# Altium project alertButton v2.0.PrjPcb
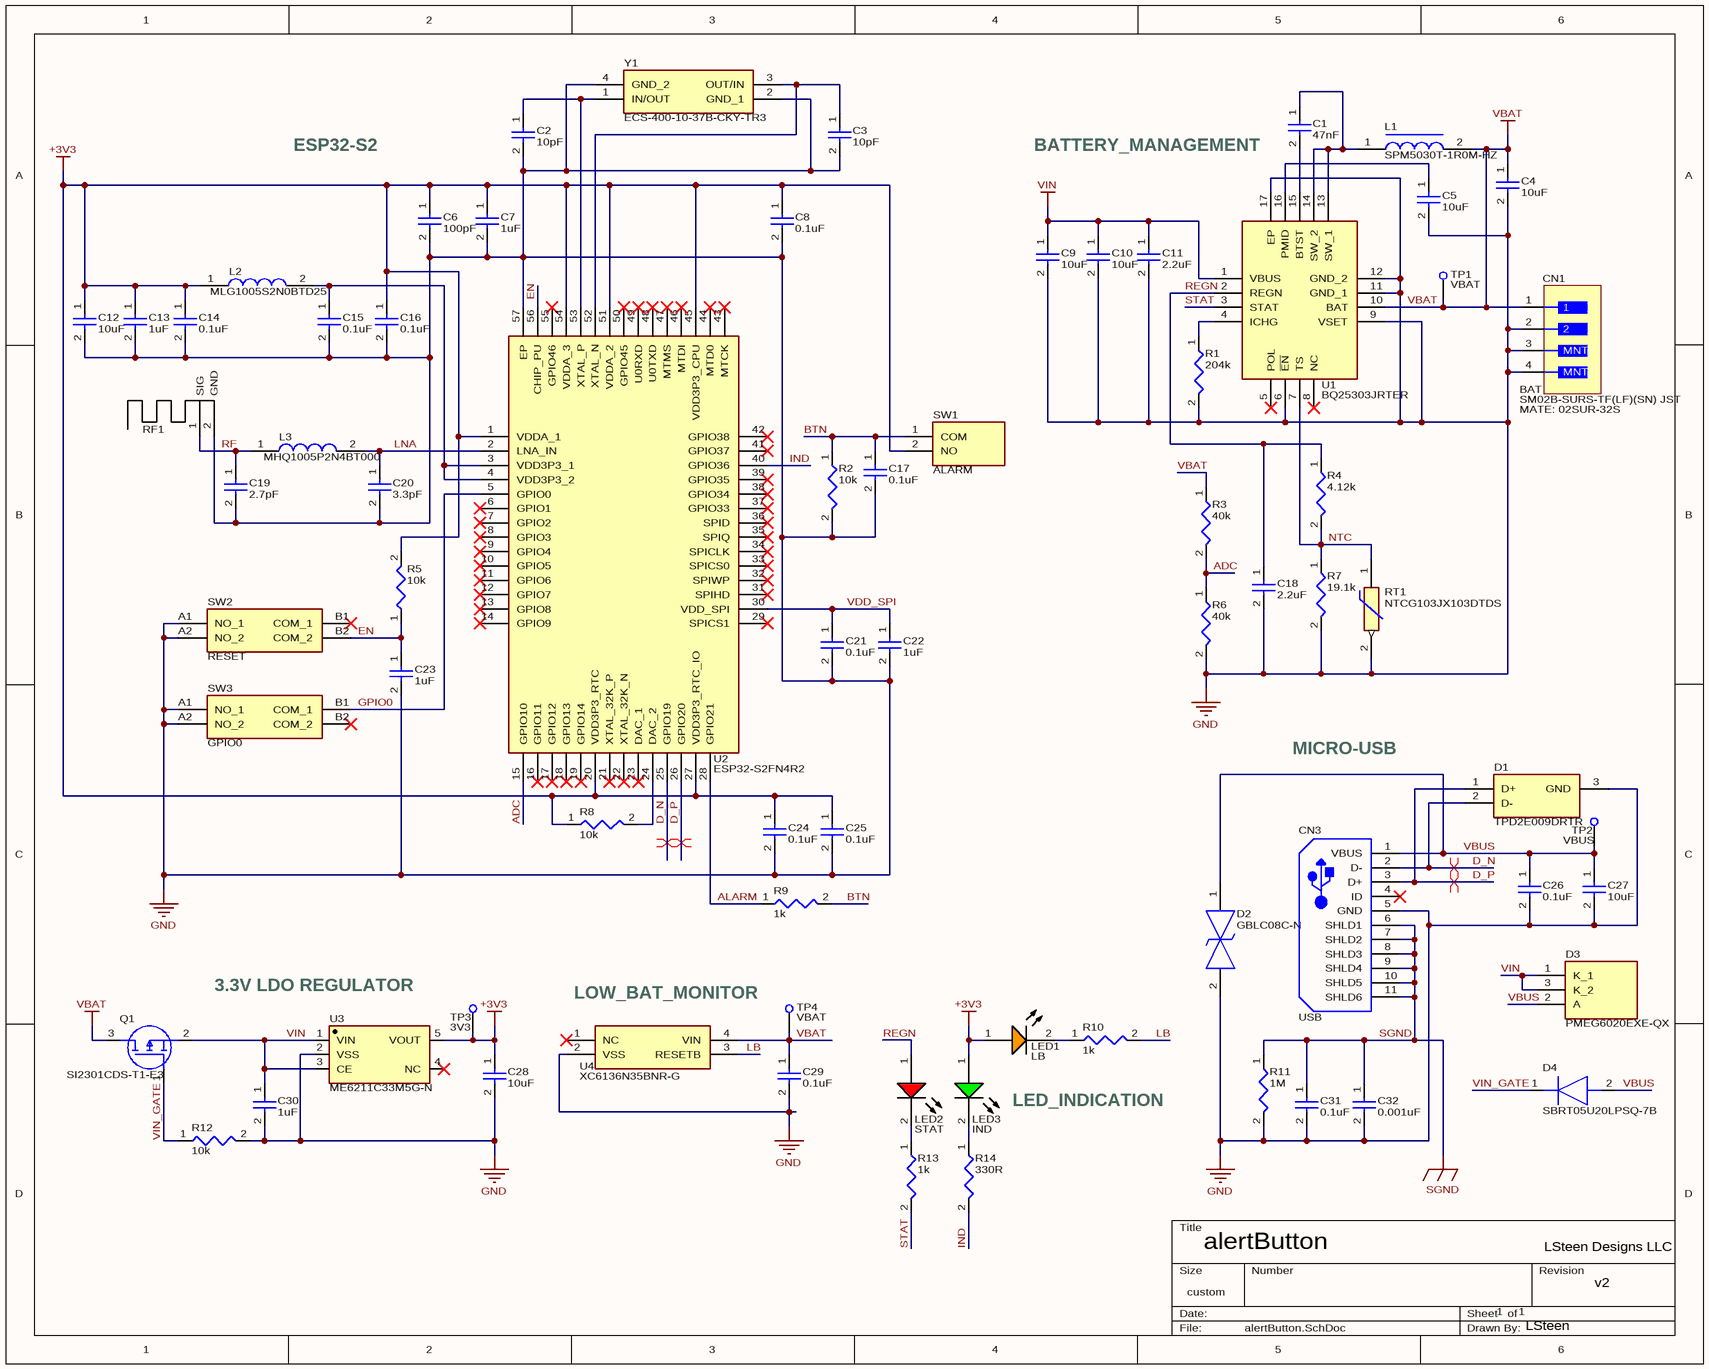
[diagram p0: alertButton.SchDoc]
1 sheet, 73 parts. Net scope: global (net labels, ports and power ports of the same name join across sheets).
Board file: alertButton.PcbDoc

## Sheet alertButton.SchDoc
size 299 x 240 mm

### Parts
C1  47nF  [CAPC1005X55N]
C2  10pF  [CAPC1005X55N]
C3  10pF  [CAPC1005X55N]
C4  10uF  [CAPC1608X90N]
C5  10uF  [CAPC1608X90N]
C6  100pF  [CAPC1005X55N]
C7  1uF  [CAPC1005X55N]
C8  0.1uF  [CAPC1005X55N]
C9  10uF  [CAPC1608X90N]
C10  10uF  [CAPC1608X90N]
C11  2.2uF  [CAPC1005X55N]
C12  10uF  [CAPC2012X140N]
C13  1uF  [CAPC1005X55N]
C14  0.1uF  [CAPC1005X55N]
C15  0.1uF  [CAPC1005X55N]
C16  0.1uF  [CAPC1005X55N]
C17  0.1uF  [CAPC1005X55N]
C18  2.2uF  [CAPC1005X55N]
C19  2.7pF  [CAPC1005X56N]
C20  3.3pF  [CAPC1005X56N]
C21  0.1uF  [CAPC1005X55N]
C22  1uF  [CAPC1005X55N]
C23  1uF  [CAPC1005X55N]
C24  0.1uF  [CAPC1005X55N]
C25  0.1uF  [CAPC1005X55N]
C26  0.1uF  [CAPC1005X55N]
C27  10uF  [CAPC1608X90N]
C28  10uF  [CAPC1608X90N]
C29  0.1uF  [CAPC1005X55N]
C30  1uF  [CAPC1005X55N]
C31  0.1uF  [CAPC1005X55N]
C32  0.001uF  [CAPC1005X55N]
CN1  BAT  [SM02B-SURS-TF(LF)(SN)]
CN3  USB  [105017-0001]
D1  TPD2E009DRTR  [SOTFL35P100X50-3N]
D2  GBLC08C-N  [SOD-323_L1.8-W1.3-LS2.5-BI]
D3  PMEG6020EXE-QX  [PMEG6020EXEQX]
D4  SBRT05U20LPSQ-7B  [SBRT05U20LPSQ7B]
L1  SPM5030T-1R0M-HZ  [SPM5030]
L2  MLG1005S2N0BTD25  [MLG1005]
L3  MHQ1005P2N4BT000  [MHQ1005]
LED1  LB  [SM0402OC]
LED2  STAT  [SM0402RC]
LED3  IND  [SM0402GC]
Q1  SI2301CDS-T1-E3  [SOT95P237X112-3N]
R1  204k  [ERA2AED122X]
R2  10k  [ERA2AED122X]
R3  40k  [ERA2AED122X]
R4  4.12k  [ERA2AED122X]
R5  10k  [ERA2AED122X]
R6  40k  [ERA2AED122X]
R7  19.1k  [ERA2AED122X]
R8  10k  [ERA2AED122X]
R9  1k  [ERA2AED122X]
R10  1k  [ERA2AED122X]
R11  1M  [ERA2AED122X]
R12  10k  [ERA2AED122X]
R13  1k  [ERA2AED122X]
R14  330R  [ERA2AED122X]
RF1  Antenna  [SWRA117D]  (value not drawn)
RT1  NTCG103JX103DTDS  [THRMC1005X55N]
SW1  ALARM  [TS1088R02026]
SW2  RESET  [EVPBB0AAB000]
SW3  GPIO0  [EVPBB0AAB000]
TP1  VBAT  [TP]  (no BOM)
TP2  VBUS  [TP]  (no BOM)
TP3  3V3  [TP]  (no BOM)
TP4  VBAT  [TP]  (no BOM)
U1  BQ25303JRTER  [QFN50P300X300X80-17N-D]
U2  ESP32-S2FN4R2  [QFN40P700X700X90-57N-D]
U3  ME6211C33M5G-N  [SOT95P270X145-5N]
U4  XC6136N35BNR-G  [XC6136C12ANRG]
Y1  ECS-400-10-37B-CKY-TR3  [ECS4001037BCKYTR3]

### Nets
+3V3: C6.1 C7.1 C8.1 C12.1 C13.1 C14.1 C16.1 C24.1 C25.1 C28.1 L2.1 LED1.1(A) LED3.1(A) R5.2 R8.1 SW1.2(NO) TP3.1 U2.1(VDDA_1) U2.20(VDD3P3_RTC) U2.27(VDD3P3_RTC_IO) U2.45(VDD3P3_CPU) U2.51(VDDA_2) U2.54(VDDA_3) U3.5(VOUT)
GND: C2.2 C3.2 C4.2 C5.2 C6.2 C7.2 C8.2 C9.2 C10.2 C11.2 C12.2 C13.2 C14.2 C15.2 C16.2 C17.2 C18.2 C19.2 C20.2 C21.2 C22.2 C23.2 C24.2 C25.2 C26.2 C27.2 C28.2 C29.2 C30.2 C31.2 C32.2 CN1.2 CN1.3(MNT) CN1.4(MNT) CN3.5(GND) D1.3(GND) D2.2 R1.2 R2.2 R6.2 R7.2 R11.2 R12.2 RF1.2(GND) RT1.2 SW2.A1(NO_1) SW2.A2(NO_2) SW3.A1(NO_1) SW3.A2(NO_2) U1.6(~{EN}) U1.9(VSET) U1.11(GND_1) U1.12(GND_2) U1.17(EP) U2.57(EP) U3.2(VSS) U4.2(VSS) Y1.2(GND_1) Y1.4(GND_2)
SGND: C31.1 C32.1 CN3.6(SHLD1) CN3.7(SHLD2) CN3.8(SHLD3) CN3.9(SHLD4) CN3.10(SHLD5) CN3.11(SHLD6) R11.1
VBAT: C4.1 C29.1 CN1.1 L1.2 Q1.3(D) R3.1 TP1.1 TP4.1 U1.10(BAT) U4.4(VIN)
VIN: C9.1 C10.1 C11.1 C30.1 D3.1(K_1) D3.3(K_2) Q1.2(S) U1.1(VBUS) U3.1(VIN) U3.3(CE)
ADC: R3.2 R6.1 U2.15(GPIO10)
ALARM: R9.1 U2.28(GPIO21)
BTN: C17.1 R2.1 R9.2 SW1.1(COM)
D_N: CN3.2(D-) D1.2(D-) U2.25(GPIO19)
D_P: CN3.3(D+) D1.1(D+) U2.26(GPIO20)
EN: C23.1 R5.1 SW2.B2(COM_2) U2.56(CHIP_PU)
GPIO0: SW3.B1(COM_1) U2.5(GPIO0)
IND: R14.2 U2.40(GPIO36)
LB: R10.2 U4.3(RESETB)
LNA: C20.1 L3.2 U2.2(LNA_IN)
NTC: R4.2 R7.1 RT1.1 U1.7(TS)
REGN: C18.1 LED2.1(A) R4.1 U1.2(REGN)
RF: C19.1 L3.1 RF1.1(SIG)
STAT: R13.2 U1.3(STAT)
VBUS: C26.1 C27.1 CN3.1(VBUS) D2.1 D3.2(A) D4.2(A) TP2.1
VDD_SPI: C21.1 C22.1 U2.30(VDD_SPI)
VIN_GATE: D4.1(K) Q1.1(G) R12.1
NetC1_1: C1.1 L1.1 U1.13(SW_1) U1.14(SW_2)
NetC1_2: C1.2 U1.15(BTST)
NetC2_1: C2.1 U2.53(XTAL_P) Y1.1(IN/OUT)
NetC3_1: C3.1 U2.52(XTAL_N) Y1.3(OUT/IN)
NetC5_1: C5.1 U1.16(PMID)
NetC15_1: C15.1 L2.2 U2.3(VDD3P3_1) U2.4(VDD3P3_2)
NetLED1_2: LED1.2(K) R10.1
NetLED2_2: LED2.2(K) R13.1
NetLED3_2: LED3.2(K) R14.1
NetR1_1: R1.1 U1.4(ICHG)
NetR8_2: R8.2 U2.24(DAC_2)

Not connected (* = marked no-connect by the designer): CN3 4(ID)*; SW2 B1(COM_1)*; SW3 B2(COM_2)*; U1 5(POL)* 8(NC)*; U2 6(GPIO1)* 7(GPIO2)* 8(GPIO3)* 9(GPIO4)* 10(GPIO5)* 11(GPIO6)* 12(GPIO7)* 13(GPIO8)* 14(GPIO9)* 16(GPIO11)* 17(GPIO12)* 18(GPIO13)* 19(GPIO14)* 21(XTAL_32K_P)* 22(XTAL_32K_N)* 23(DAC_1)* 29(SPICS1)* 31(SPIHD)* 32(SPIWP)* 33(SPICS0)* 34(SPICLK)* 35(SPIQ)* 36(SPID)* 37(GPIO33)* 38(GPIO34)* 39(GPIO35)* 41(GPIO37)* 42(GPIO38)* 43(MTCK)* 44(MTD0)* 46(MTDI)* 47(MTMS)* 48(U0TXD)* 49(U0RXD)* 50(GPIO45)* 55(GPIO46)*; U3 4(NC)*; U4 1(NC)*

### Layout directives
differential pair; differential pair class USB 2.0: D_N, D_P

### Notes on the sheet
- ESP32-S2
- BATTERY_MANAGEMENT
- (near CN1) MATE: 02SUR-32S
- (near CN1) SM02B-SURS-TF(LF)(SN) JST
- MICRO-USB
- 3.3V LDO REGULATOR
- (near U4) LOW_BAT_MONITOR
- LED_INDICATION
- alertButton
- LSteen Designs LLC
- 1
- v2
- LSteen

### Library data of the parts
C1-C3 C6-C8 C11 C13-C18 C21-C26 C29-C32 = C0402: Height: 0.55mm
C4 C5 C9 C10 C27 C28 = C0603: Height: 0.9mm
C12 = C0805: Height: 1.4mm
C19 = 04023U2R7BAT2A: C0402; Manufacturer_Name: Kyocera AVX; Datasheet Link: http://www.mouser.com/catalog/supplier/library/pdf/AVXSurfaceMountCeramic.pdf; Height: 0.56mm; Manufacturer_Part_Number: 04023U2R7BAT2A; Mouser Part Number: 581-04023U2.7B; Mouser Price/Stock: https://www.mouser.co.uk/ProductDetail/AVX/04023U2R7BAT2A?qs=btToBMqunHouu%252BPwi6Y2gg%3D%3D; Arrow Part Number: 04023U2R7BAT2A; Arrow Price/Stock: https://www.arrow.com/en/products/04023u2r7bat2a/avx
C20 = 04023A3R3CAT2A: C0402; Manufacturer_Name: Kyocera AVX; Datasheet Link: http://www.mouser.com/catalog/supplier/library/pdf/AVXSurfaceMountCeramic.pdf; Height: 0.56mm; Manufacturer_Part_Number: 04023A3R3CAT2A; Arrow Part Number: 04023A3R3CAT2A; Arrow Price/Stock: https://www.arrow.com/en/products/04023a3r3cat2a/avx
CN1 = SM02B-SURS-TF(LF)(SN): Connector; Manufacturer_Name: Apem; Datasheet Link: https://media.digikey.com/pdf/Data%20Sheets/APEM%20Components%20PDFs/APTCLGTV.pdf; Height: 1.87mm; Manufacturer_Part_Number: SM02B-SURS-TF(LF)(SN); Mouser Part Number: 306-SM02B-SURS-TF(LF)(SN); Mouser Price/Stock: https://www.mouser.co.uk/ProductDetail/Apem/APTCLGTVTR?qs=ikKlZSMjbcRNf%252Bwzp31ctg%3D%3D; Supplier 1: Mouser; LCSC_Part_Number: C566239
CN3 = 105017-0001: Micro USB Connector; Manufacturer_Name: Molex; Manufacturer_Part_Number: 105017-0001; Mouser Part Number: 538-105017-0001; Supplier 1: Mouser; Supplier 2: Digikey; Supplier Part Number 1: 538-105017-0001; Supplier Part Number 2: WM1399CT-ND
D1 = TPD2E009DRTR: Integrated Circuit; Manufacturer_Name: Texas Instruments; Datasheet Link: https://www.ti.com/lit/ds/symlink/tpd2e009.pdf?ts=1621336941637&ref_url=https%253A%252F%252Fwww.google.com%252F; Height: 0.5mm; Manufacturer_Part_Number: TPD2E009DRTR; Mouser Part Number: 595-TPD2E009DRTR; Mouser Price/Stock: https://www.mouser.co.uk/ProductDetail/Texas-Instruments/TPD2E009DRTR?qs=XGzIaZb%2FFYLhG8oL%2FM05Rg%3D%3D; Arrow Part Number: TPD2E009DRTR; Arrow Price/Stock: https://www.arrow.com/en/products/tpd2e009drtr/texas-instruments?region=nac; Supplier 1: Mouser; Supplier Part Number 1: 595-TPD2E009DRTR
D2 = GBLC08C-N: ESD DIODE-BI_LCSC#C314256
D3 = PMEG6020EXE-QX: Schottky Diode; Manufacturer_Name: Nexperia; Datasheet Link: https://assets.nexperia.com/documents/data-sheet/PMEG6020EXE-Q.pdf; Height: 1mm; Manufacturer_Part_Number: PMEG6020EXE-QX; Supplier 1: Mouser; Supplier Part Number 1: 771-PMEG6020EXE-Q
D4 = SBRT05U20LPSQ-7B: Diode; Manufacturer_Name: Diodes Incorporated; Datasheet Link: https://componentsearchengine.com/Datasheets/2/SBRT05U20LPSQ-7B.pdf; Height: 0.4mm; Manufacturer_Part_Number: SBRT05U20LPSQ-7B; Mouser Part Number: 621-SBRT05U20LPSQ-7B; Mouser Price/Stock: https://www.mouser.co.uk/ProductDetail/Diodes-Incorporated/SBRT05U20LPSQ-7B?qs=Cb2nCFKsA8rYOfAdmv62Rg%3D%3D; Arrow Part Number: SBRT05U20LPSQ-7B; Arrow Price/Stock: https://www.arrow.com/en/products/sbrt05u20lpsq-7b/diodes-incorporated?region=nac
L1 = SPM5030T-1R0M-HZ: Inductor (FeSi Core); Manufacturer_Name: TDK; Datasheet Link: https://product.tdk.com/system/files/dam/doc/product/inductor/inductor/smd/catalog/inductor_automotive_power_spm5030-hz_en.pdf; Manufacturer_Part_Number: SPM5030T-1R0M-HZ; Mouser Part Number: 810-SPM5030T-1R0M-HZ; Mouser Price/Stock: https://www.mouser.co.uk/ProductDetail/TDK/SPM5030T-1R0M-HZ?qs=lYGu3FyN48f37%252BxFpB09sg%3D%3D; Arrow Part Number: SPM5030T-1R0M-HZ; Arrow Price/Stock: https://www.arrow.com/en/products/spm5030t-1r0m-hz/tdk
L2 = MLG1005S2N0BTD25: Inductor; Manufacturer_Name: TDK; Datasheet Link: https://product.tdk.com/system/files/dam/doc/product/inductor/inductor/smd/catalog/inductor_automotive_high-frequency_mlg1005s_en.pdf; Manufacturer_Part_Number: MLG1005S2N0BTD25; Mouser Part Number: 810-MLG1005S2N0BTD25; Mouser Price/Stock: https://www.mouser.co.uk/ProductDetail/TDK/MLG1005S2N0BTD25?qs=u4%252BEJ9urDARbfrK%2Fvep%2FGg%3D%3D; Arrow Part Number: MLG1005S2N0BTD25; Arrow Price/Stock: https://www.arrow.com/en/products/mlg1005s2n0btd25/tdk; Supplier 1: LCSC; Supplier Part Number 1: C404617; Supplier 2: Mouser; Supplier Part Number 2: 810-MLG1005S2N0BTD25
L3 = MHQ1005P2N4BT000: Inductor; Manufacturer_Name: TDK; Datasheet Link: https://product.tdk.com/system/files/dam/doc/product/inductor/inductor/smd/catalog/inductor_commercial_high-frequency_mhq1005p_en.pdf; Manufacturer_Part_Number: MHQ1005P2N4BT000
LED1 = SM0402OC: LED ORANGE; Manufacturer_Name: Bivar; Datasheet Link: https://www.bivar.com/parts_content/Datasheets/SM0402OC.pdf; Height: 0.6524mm; Manufacturer_Part_Number: SM0402OC; Mouser Part Number: 749-SM0402OC; Arrow Part Number: SM0402OC
LED2 = SM0402RC: LED RED; Manufacturer_Name: Bivar; Datasheet Link: https://www.bivar.com/parts_content/Datasheets/SM0402RC.pdf; Height: 0.6524mm; Manufacturer_Part_Number: SM0402RC; Mouser Part Number: 749-SM0402RC; Mouser Price/Stock: https://www.mouser.co.uk/ProductDetail/Bivar/SM0402RC?qs=AQlKX63v8RtYE%2FAH%2F7Qnaw%3D%3D; Arrow Part Number: SM0402RC; Arrow Price/Stock: https://www.arrow.com/en/products/sm0402rc/bivar?region=nac
LED3 = SM0402GC: LED GREEN; Manufacturer_Name: Bivar; Datasheet Link: https://www.bivar.com/parts_content/Datasheets/SM0402GC.pdf; Height: 0.6524mm; Manufacturer_Part_Number: SM0402GC; Mouser Part Number: 749-SM0402GC; Mouser Price/Stock: https://www.mouser.co.uk/ProductDetail/Bivar/SM0402GC?qs=AQlKX63v8RuLeMPnNMtW7A%3D%3D; Arrow Part Number: SM0402GC; Arrow Price/Stock: https://www.arrow.com/en/products/sm0402gc/bivar?region=nac
Q1 = SI2301CDS-T1-E3: MOSFET (P-Channel); Manufacturer_Name: Vishay; Datasheet Link: https://componentsearchengine.com/Datasheets/2/SI2301CDS-T1-E3.pdf; Height: 1.12mm; Manufacturer_Part_Number: SI2301CDS-T1-E3; Mouser Part Number: 781-SI2301CDS-E3; Mouser Price/Stock: https://www.mouser.co.uk/ProductDetail/Vishay-Semiconductors/SI2301CDS-T1-E3?qs=45wPT2wjtGkQH%252ByrbRpz4Q%3D%3D; Arrow Part Number: SI2301CDS-T1-E3; Arrow Price/Stock: https://www.arrow.com/en/products/si2301cds-t1-e3/vishay?region=nac; Supplier 1: Mouser; Supplier Part Number 1: 781-SI2301CDS-E3
R1-R14 = R0402: Height: 0.4mm
RT1 = NTCG103JX103DTDS: Thermistor; Manufacturer_Name: TDK; Datasheet Link: https://product.tdk.com/system/files/dam/doc/product/sensor/ntc/chip-ntc-thermistor/catalog/tpd_automotive_ntc-thermistor_ntcg_en.pdf; Height: 0.55mm; Manufacturer_Part_Number: NTCG103JX103DTDS; Mouser Part Number: 810-NTCG103JX103DTDS; Mouser Price/Stock: https://www.mouser.co.uk/ProductDetail/TDK/NTCG103JX103DTDS?qs=cNoPOocMWw0mnAOC7PMXMw%3D%3D; Arrow Part Number: NTCG103JX103DTDS; Arrow Price/Stock: https://www.arrow.com/en/products/ntcg103jx103dtds/tdk?region=nac; Supplier 1: Mouser; Supplier Part Number 1: 810-NTCG103JX103DTDS
SW1 = TS-1088R-02026: Switch; Manufacturer_Name: XUNPU; Datasheet Link: https://datasheet.lcsc.com/szlcsc/1912111437_XUNPU-TS-1088R-02026_C455280.pdf; Manufacturer_Part_Number: TS-1088R-02026
SW2 SW3 = EVP-BB0AAB000: Switch; Manufacturer_Name: Panasonic; Datasheet Link: https://componentsearchengine.com/Datasheets/1/EVP-BB0AAB000.pdf; Height: 0.6mm; Manufacturer_Part_Number: EVP-BB0AAB000; Mouser Part Number: 667-EVP-BB0AAB000; Mouser Price/Stock: https://www.mouser.co.uk/ProductDetail/Panasonic/EVP-BB0AAB000?qs=PzGy0jfpSMt797eGA9Hkvg%3D%3D; Arrow Part Number: EVP-BB0AAB000; Arrow Price/Stock: https://www.arrow.com/en/products/evp-bb0aab000/panasonic?region=nac
TP1-TP4 = TestPoint
U1 = BQ25303JRTER: Integrated Circuit; Manufacturer_Name: Texas Instruments; Datasheet Link: https://www.ti.com/lit/ds/symlink/bq25303j.pdf?ts=1614639374775&ref_url=https%253A%252F%252Fwww.ti.com%252Fpower-management%252Fbattery-management%252Fcharger-ics%252Fproducts.html; Height: 0.8mm; Manufacturer_Part_Number: BQ25303JRTER; Mouser Part Number: 595-BQ25303JRTER; Mouser Price/Stock: https://www.mouser.co.uk/ProductDetail/Texas-Instruments/BQ25303JRTER?qs=DRkmTr78QARA1C7%2F12q3og%3D%3D; Arrow Part Number: BQ25303JRTER; Arrow Price/Stock: https://www.arrow.com/en/products/bq25303jrter/texas-instruments?region=nac; Supplier 1: Mouser; Supplier Part Number 1: 595-BQ25303JRTER
U2 = ESP32-S2FN4R2: Integrated Circuit; Manufacturer_Name: Espressif Systems; Datasheet Link: https://www.espressif.com/sites/default/files/documentation/esp32-s2_datasheet_en.pdf; Height: 0.9mm; Manufacturer_Part_Number: ESP32-S2FN4R2; Mouser Part Number: 356-ESP32-S2FN4R2; Mouser Price/Stock: https://www.mouser.co.uk/ProductDetail/Espressif-Systems/ESP32-S2FN4R2?qs=pUKx8fyJudDnZ43tIkHUCQ%3D%3D; Supplier 1: Mouser; Supplier Part Number 1: 356-ESP32-S2FN4R2
U3 = ME6211C33M5G-N: LCSC +3.3V LDO 500mA VDIF=120mV@100mA
U4 = XC6136N35BNR-G: Integrated Circuit; Manufacturer_Name: Torex; Datasheet Link: https://www.torexsemi.com/file/xc6136/XC6136.pdf; Height: 1.1mm; Manufacturer_Part_Number: XC6136N35BNR-G; Mouser Part Number: 865-XC6136N35BNR-G; Mouser Price/Stock: https://www.mouser.co.uk/ProductDetail/Torex-Semiconductor/XC6136N35BNR-G?qs=T3oQrply3y%252BoEyjYGdDjug%3D%3D; Supplier 1: Mouser; Supplier Part Number 1: 865-XC6136N35BNR-G
Y1 = ECS-400-10-37B-CKY-TR3: Crystal or Oscillator; Manufacturer_Name: ECS; Datasheet Link: https://ecsxtal.com/store/pdf/ECX-1637B.pdf; Height: 0.5mm; Manufacturer_Part_Number: ECS-400-10-37B-CKY-TR3; Mouser Part Number: 520-EC4001037BCKYTR3; Mouser Price/Stock: https://www.mouser.co.uk/ProductDetail/ECS/ECS-400-10-37B-CKY-TR3?qs=TCDPyi3sCW2VtaBG%252B2IQWA%3D%3D; Arrow Part Number: ECS-400-10-37B-CKY-TR3; Arrow Price/Stock: https://www.arrow.com/en/products/ecs-400-10-37b-cky-tr3/ecs-international?region=nac; Supplier 1: Mouser; Supplier Part Number 1: 520-EC4001037BCKYTR3